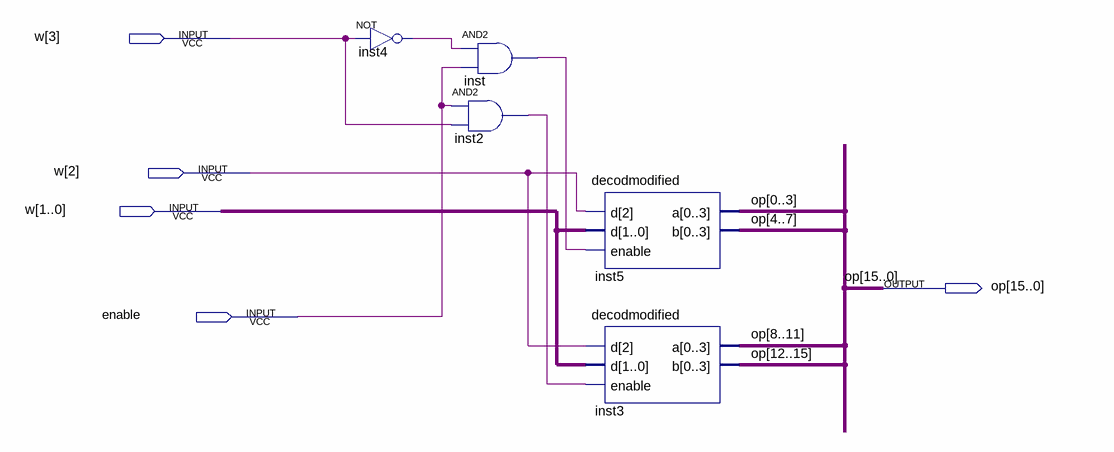
[diagram p0: schematic sheet]
// Quartus schematic 416decodemodified.bdf as structural Verilog: 5 symbols, 5 pins
module \416decodemodified  (
  input  [3:0] w,
  input  enable,
  output [15:0] op
);

  wire inst2_out, inst4_out, inst_out;

  not inst4 (inst4_out, w[3]);
  and inst (inst_out, inst4_out, enable);
  and inst2 (inst2_out, enable, w[3]);
  decodmodified inst5 (
    .d(w[2:0]), .enable(inst_out), .a({op[0], op[1], op[2], op[3]}), .b({op[4], op[5], op[6], op[7]}));
  decodmodified inst3 (
    .d(w[2:0]), .enable(inst2_out), .a({op[8], op[9], op[10], op[11]}), .b({op[12], op[13], op[14], op[15]}));
endmodule
